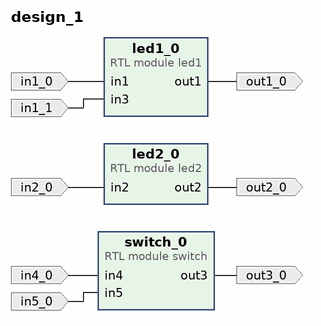
[diagram p0: block diagram of the top level]
# Vivado block design design_1, xc7z010clg400-1, Vivado 2023.2
create_bd_design design_1

create_bd_port -dir I in1_0
create_bd_port -dir O out1_0
create_bd_port -dir I in2_0
create_bd_port -dir O out2_0
create_bd_port -dir I in1_1
create_bd_port -dir I in4_0
create_bd_port -dir I in5_0
create_bd_port -dir O out3_0

create_bd_cell -type module -reference led1 led1_0
create_bd_cell -type module -reference led2 led2_0
create_bd_cell -type module -reference switch switch_0

# ---- connections ----

connect_bd_net -net in1_0_1 [get_bd_ports in1_0] [get_bd_pins led1_0/in1]
connect_bd_net -net in1_1_1 [get_bd_ports in1_1] [get_bd_pins led1_0/in3]
connect_bd_net -net in2_0_1 [get_bd_ports in2_0] [get_bd_pins led2_0/in2]
connect_bd_net -net in4_0_1 [get_bd_ports in4_0] [get_bd_pins switch_0/in4]
connect_bd_net -net in5_0_1 [get_bd_ports in5_0] [get_bd_pins switch_0/in5]
connect_bd_net [get_bd_pins led1_0/out1] [get_bd_ports out1_0]
connect_bd_net [get_bd_pins led2_0/out2] [get_bd_ports out2_0]
connect_bd_net [get_bd_pins switch_0/out3] [get_bd_ports out3_0]

validate_bd_design
save_bd_design
